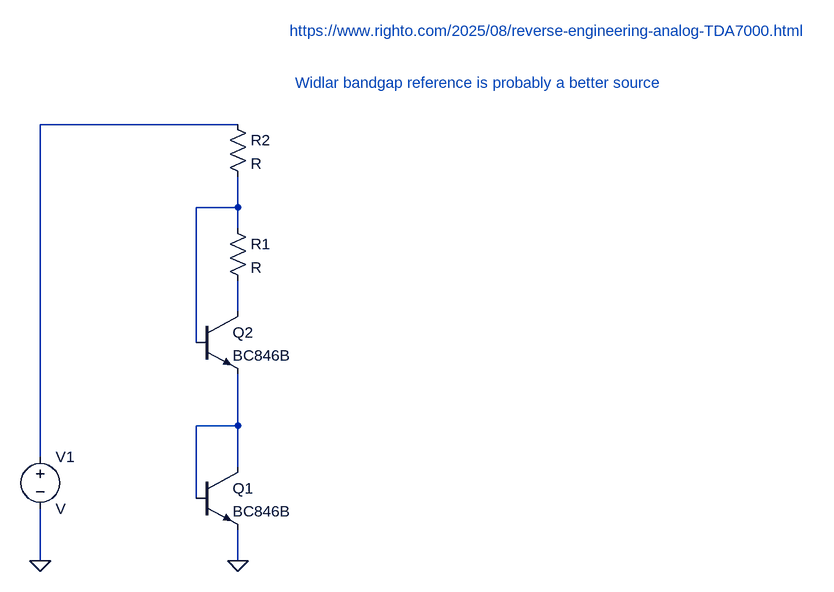
[diagram p0: schematic voltage_reference.asc]
voltage_reference.asc, the LTspice schematic file:
Version 4
SHEET 1 1284 680
WIRE 288 -336 -16 -336
WIRE 288 -208 288 -256
WIRE 288 -208 224 -208
WIRE 288 -176 288 -208
WIRE 288 -48 288 -96
WIRE 224 0 224 -208
WIRE 288 128 288 48
WIRE 288 128 224 128
WIRE -16 176 -16 -336
WIRE 288 192 288 128
WIRE 224 240 224 128
WIRE -16 336 -16 256
WIRE 288 336 288 288
FLAG -16 336 0
FLAG 288 336 0
SYMBOL voltage -16 160 R0
SYMATTR InstName V1
SYMBOL npn 224 192 R0
SYMATTR InstName Q1
SYMATTR Value BC846B
SYMBOL npn 224 -48 R0
SYMATTR InstName Q2
SYMATTR Value BC846B
SYMBOL res 272 -192 R0
SYMATTR InstName R1
SYMBOL res 272 -352 R0
SYMATTR InstName R2
TEXT 368 -480 Left 2 ;https://www.righto.com/2025/08/reverse-engineering-analog-TDA7000.html
TEXT 376 -400 Left 2 ;Widlar bandgap reference is probably a better source

The netlist it stands for:
* voltage_reference.asc
V1 N001 0 V
Q1 N004 N004 0 0 BC846B
Q2 N003 N002 N004 0 BC846B
R1 N002 N003 R
R2 N001 N002 R
.model NPN NPN
.model PNP PNP
.lib standard.bjt
* https://www.righto.com/2025/08/reverse-engineering-analog-TDA7000.html
* Widlar bandgap reference is probably a better source
.backanno
.end